# EAGLE design Atmega328 (EAGLE 7.2.0)
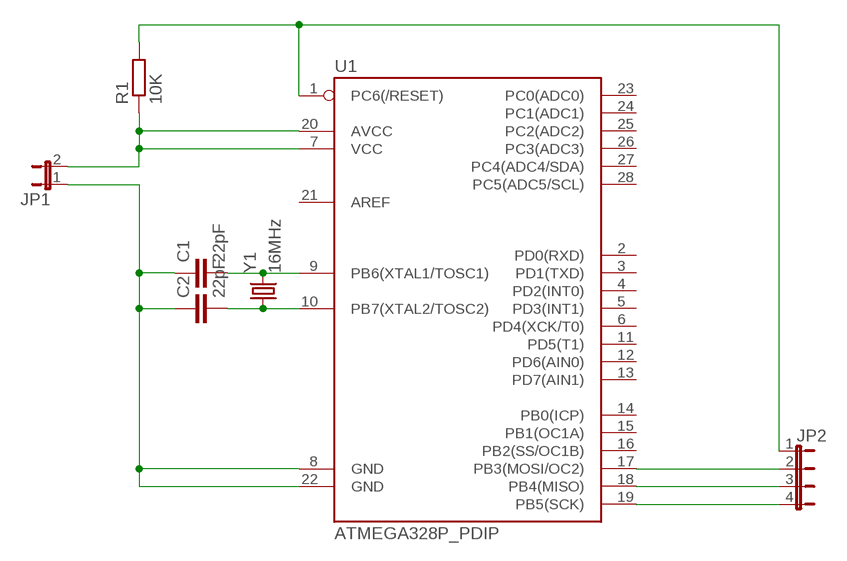
[diagram p0: schematic, sheet 1]

## Parts
C1  22pF  C-EU025-024X044  [C025-024X044]
C2  22pF  C-EU025-024X044  [C025-024X044]
JP1  JP1E  [JP1]
JP2  JP4E  [JP4]
R1  10K  R-EU_0207/15  [0207/15]
U1  ATMEGA328P_PDIP  [DIL28-3]
Y1  16MHz  CRYSTALHC49US  [HC49US]

## Nets
N$1: C1.2 U1.9(PB6(XTAL1/TOSC1)) Y1.2
N$2: C2.2 U1.10(PB7(XTAL2/TOSC2)) Y1.1
N$3: C1.1 C2.1 JP1.1 U1.8(GND) U1.22(GND)
N$4: JP1.2 R1.1 U1.7(VCC) U1.20(AVCC)
N$7: JP2.1 R1.2 U1.1(PC6(/RESET))
N$8: JP2.2 U1.17(PB3(MOSI/OC2))
N$9: JP2.3 U1.18(PB4(MISO))
N$10: JP2.4 U1.19(PB5(SCK))
Unconnected: U1.2(PD0(RXD)) U1.3(PD1(TXD)) U1.4(PD2(INT0)) U1.5(PD3(INT1)) U1.6(PD4(XCK/T0)) U1.11(PD5(T1)) U1.12(PD6(AIN0)) U1.13(PD7(AIN1)) U1.14(PB0(ICP)) U1.15(PB1(OC1A)) U1.16(PB2(SS/OC1B)) U1.21(AREF) U1.23(PC0(ADC0)) U1.24(PC1(ADC1)) U1.25(PC2(ADC2)) U1.26(PC3(ADC3)) U1.27(PC4(ADC4/SDA)) U1.28(PC5(ADC5/SCL))

## Library data of the parts
C1 C2 = rcl:C-EU: CAPACITOR, European symbol
JP1 = jumper:JP1E: JUMPER
JP2 = jumper:JP4E: JUMPER
R1 = rcl:R-EU_: RESISTOR, European symbol
U1 = SparkFun-DigitalIC:ATMEGA328P_PDIP: uC used in the Arduino 32kb flash, 1k EEPROM, 2k SRAM This is the through-hole version of this chip.
Y1 = SparkFun-FreqCtrl:CRYSTAL: Various standard crystals. Proven footprints.

## Board
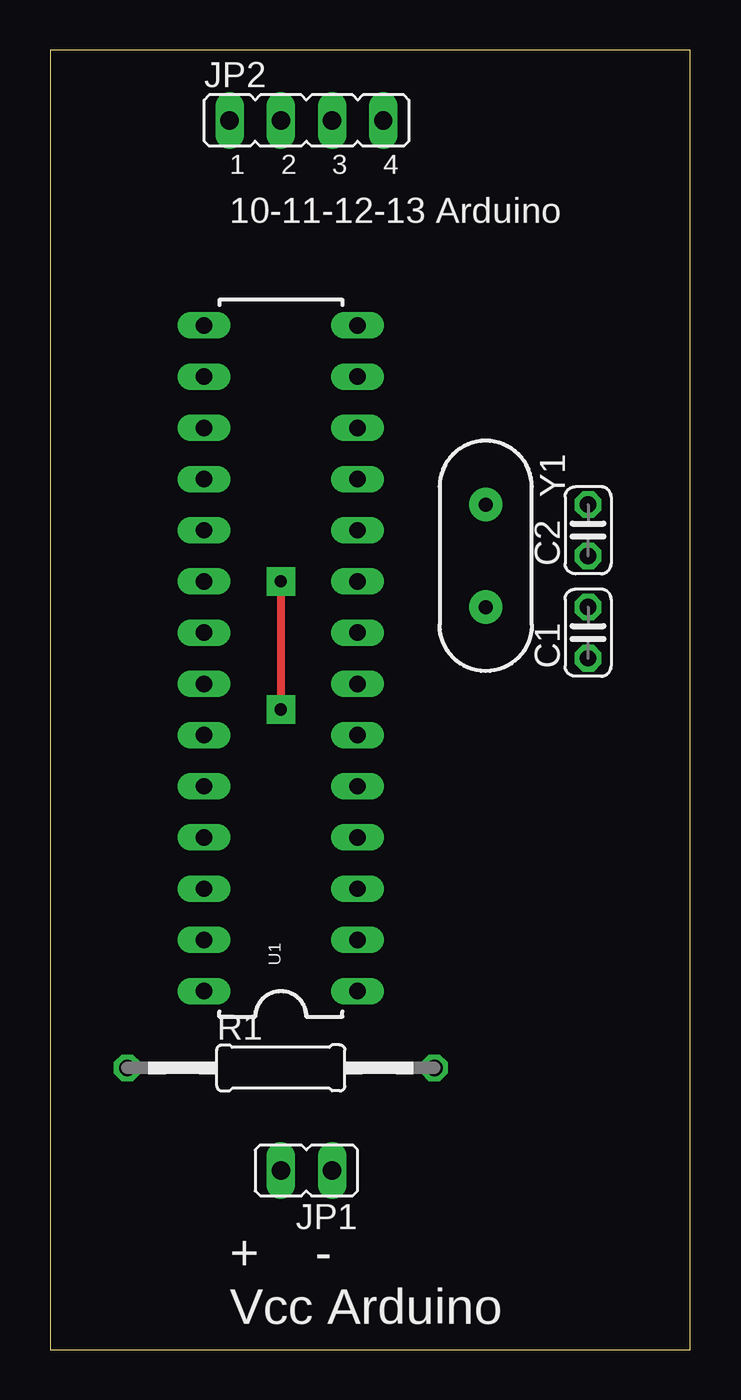
[diagram p1: board, top side]
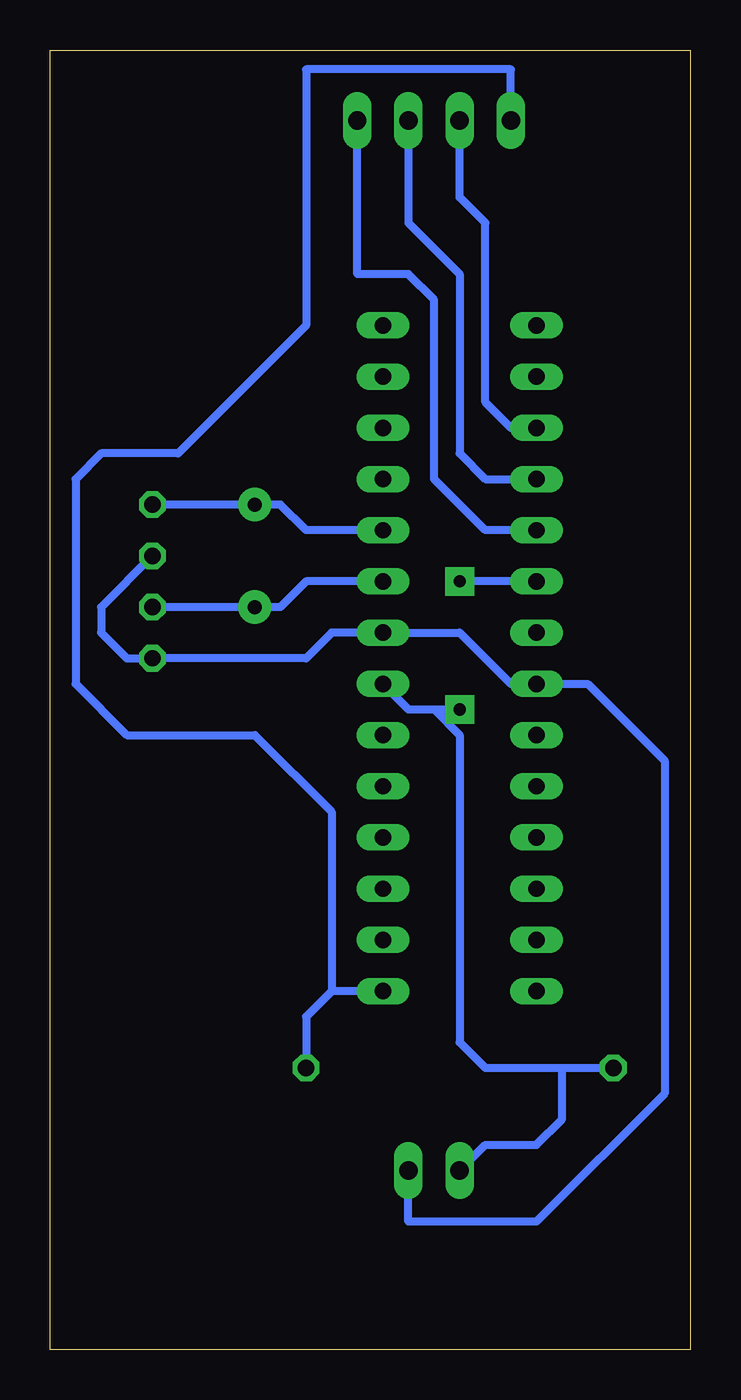
[diagram p2: board, bottom side, seen from below]

Size 31.73 x 64.44 mm. Coordinates in mm from the lower left corner, seen from the top.
Outline: 0,0 31.73,0 31.73,64.44 0,64.44 0,0
Copper layers (1*16): Top 0.035mm / dielectric 1.5mm / Bottom 0.035mm
Design rules "default": minimum track width 10mil, minimum drill 24mil, track to track 8mil, track to pad 8mil, pad to pad 8mil, via to via 8mil, smd to smd 8mil, copper to edge 40mil, drill to drill 8mil, minimum pad ring 10mil, minimum via ring 8mil, stop-mask expansion 4mil, vias tented up to drill 0mil, thermal gap 10mil

### Footprints (pad centres in the part's own frame; a part is rotated, then mirrored left to right if it is on the bottom)
C025-024X044 = drill 0.813 octagon: 1 -1.27,0; 2 1.27,0
JP1 = drill 0.914 long: 1 0,-1.27; 2 0,1.27
JP4 = drill 0.914 long: 1 -3.81,0; 2 -1.27,0; 3 1.27,0; 4 3.81,0
0207/15 = drill 0.813 octagon: 1 -7.62,0; 2 7.62,0
DIL28-3 = drill 0.813 long: 1 -16.51,-3.81; 2 -13.97,-3.81; 3 -11.43,-3.81; 4 -8.89,-3.81; 5 -6.35,-3.81; 6 -3.81,-3.81; 7 -1.27,-3.81; 8 1.27,-3.81; 9 3.81,-3.81; 10 6.35,-3.81; 11 8.89,-3.81; 12 11.43,-3.81; 13 13.97,-3.81; 14 16.51,-3.81; 15 16.51,3.81; 16 13.97,3.81; 17 11.43,3.81; 18 8.89,3.81; 19 6.35,3.81; 20 3.81,3.81; 21 1.27,3.81; 22 -1.27,3.81; 23 -3.81,3.81; 24 -6.35,3.81; 25 -8.89,3.81; 26 -11.43,3.81; 27 -13.97,3.81; 28 -16.51,3.81
HC49US = drill 0.7 pad 1.651: 1 -2.54,0; 2 2.54,0

### Placement (x,y rotation side)
C1  26.67,35.56 90 top
C2  26.67,40.64 90 top
JP1  12.7,8.89 90 top
JP2  12.7,60.96 0 top
R1  11.43,13.97 0 top
U1  11.43,34.29 90 top
Y1  21.59,39.37 270 top

### Tracks (layer width: path | path; a pad name or v marks a point on that pad's centre or on a via)
N$1
  Bottom 0.406: U1.9 19.05,38.1 20.32,36.83 Y1.2 C1.2
N$2
  Bottom 0.406: U1.10 19.05,40.64 20.32,41.91 Y1.1 C2.2
N$3
  Bottom 0.406: C2.1 29.21,36.83 29.21,35.56 27.94,34.29 C1.1 19.05,34.29 17.78,35.56 U1.8 11.43,35.56 8.89,33.02 U1.22 5.08,33.02 1.27,29.21 1.27,12.7 7.62,6.35 13.97,6.35 JP1.1
N$4  (via drill 0.6 pad 1.42)
  Top 0.406: v11.43,38.1 v11.43,31.75
  Bottom 0.406: U1.7 13.97,31.75 12.7,31.75 | 12.7,31.75 11.43,30.48 11.43,15.24 10.16,13.97 6.35,13.97 | 6.35,13.97 R1.1 | JP1.2 10.16,10.16 7.62,10.16 6.35,11.43 6.35,13.97 | 12.7,31.75 v11.43,31.75 | U1.20 v11.43,38.1
N$7
  Bottom 0.406: U1.1 17.78,17.78 | 17.78,17.78 19.05,16.51 R1.2 | JP2.1 8.89,63.5 19.05,63.5 19.05,50.8 25.4,44.45 29.21,44.45 30.48,43.18 30.48,33.02 27.94,30.48 21.59,30.48 17.78,26.67 17.78,17.78
N$8
  Bottom 0.406: U1.17 8.89,45.72 10.16,46.99 10.16,55.88 11.43,57.15 JP2.2
N$9
  Bottom 0.406: JP2.3 13.97,55.88 11.43,53.34 11.43,44.45 10.16,43.18 U1.18
N$10
  Bottom 0.406: U1.19 10.16,40.64 12.7,43.18 12.7,52.07 13.97,53.34 16.51,53.34 JP2.4

### Text on the board
tPlace: 10-11-12-13 Arduino | + - / Vcc Arduino